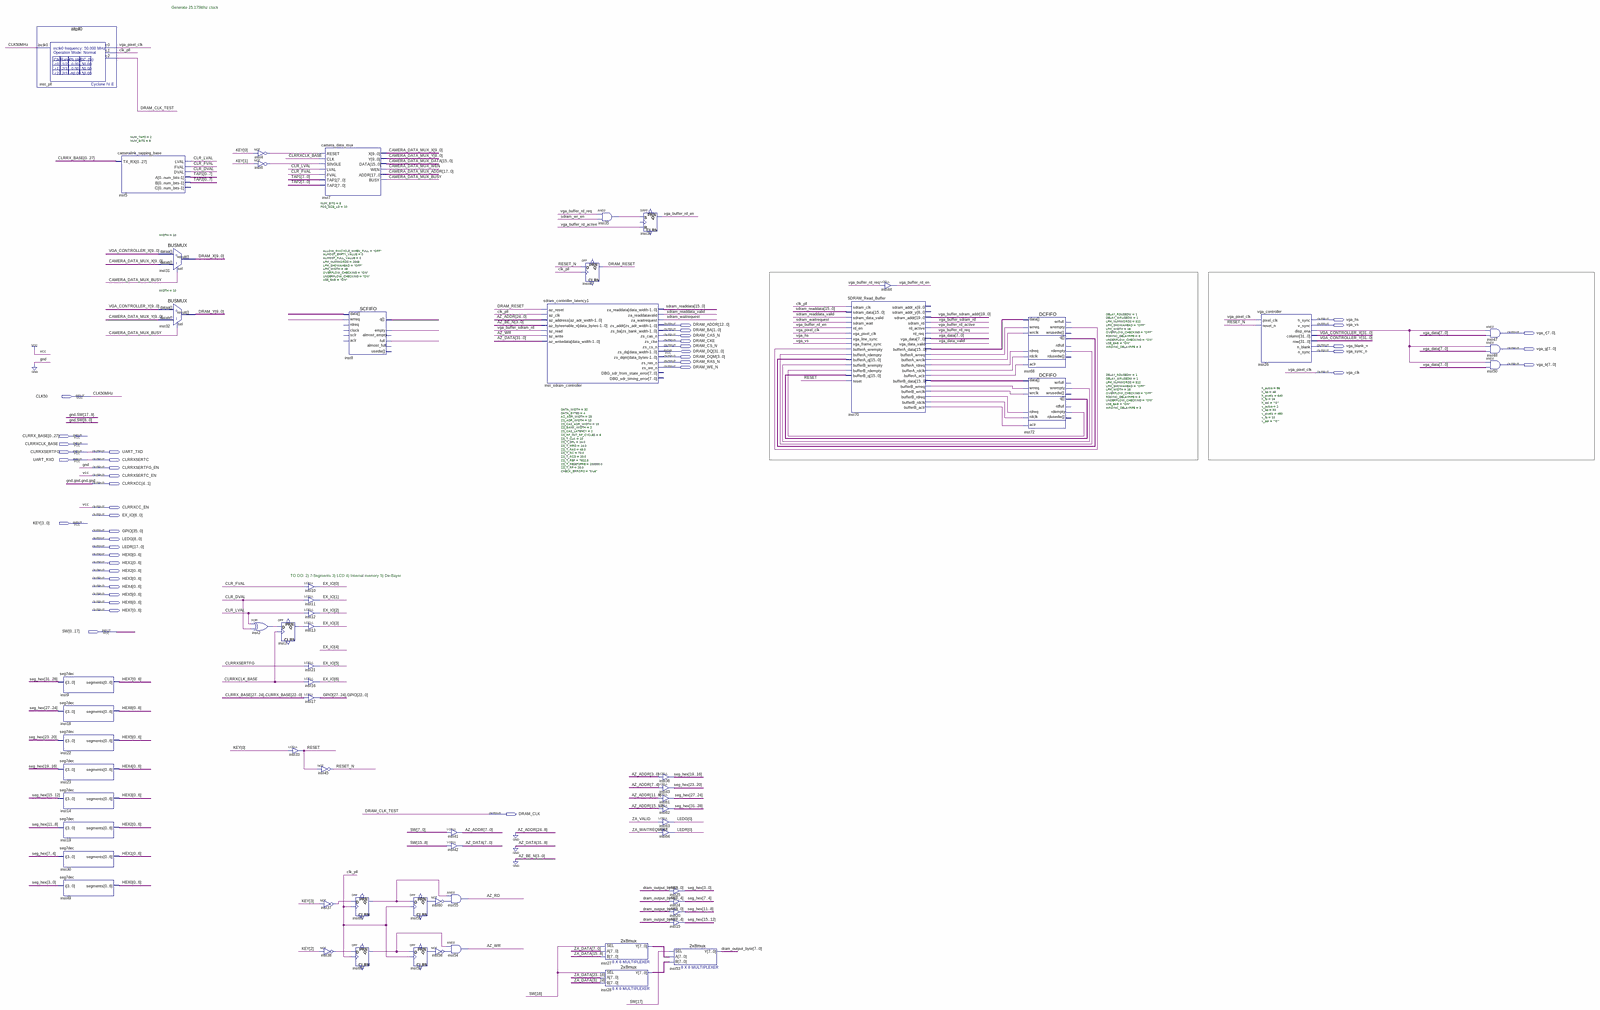
[diagram p0: schematic sheet, whole]
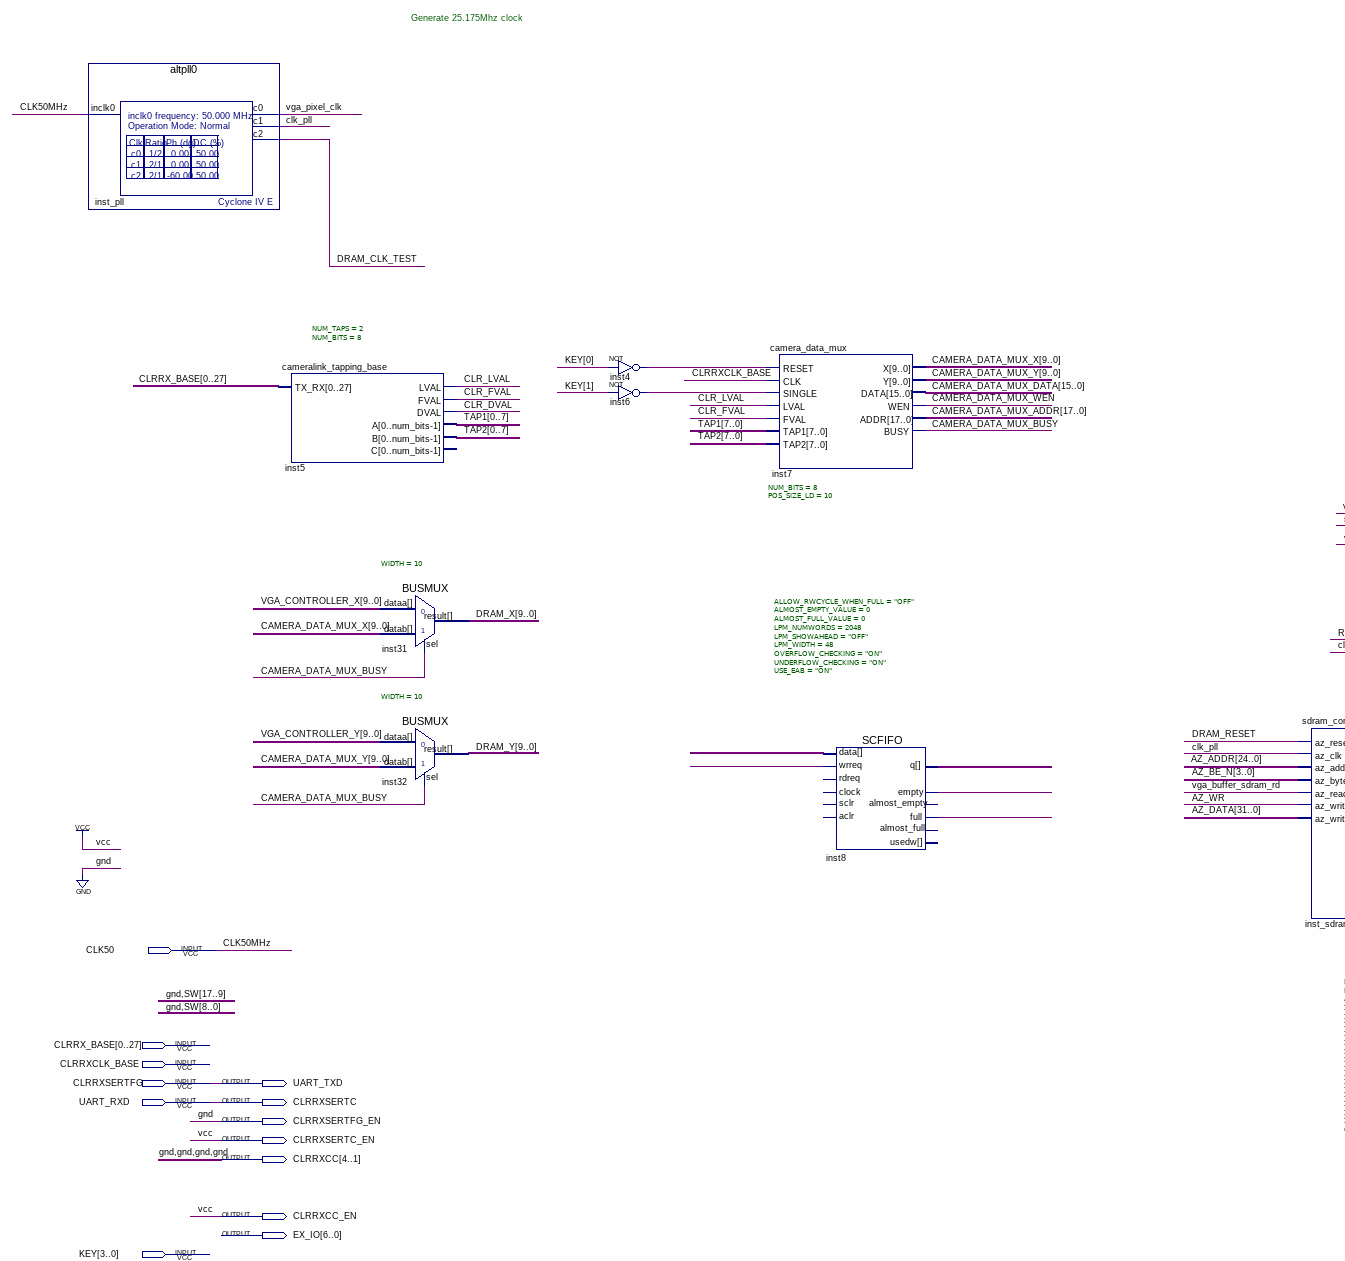
[diagram p1: schematic sheet, upper left part]
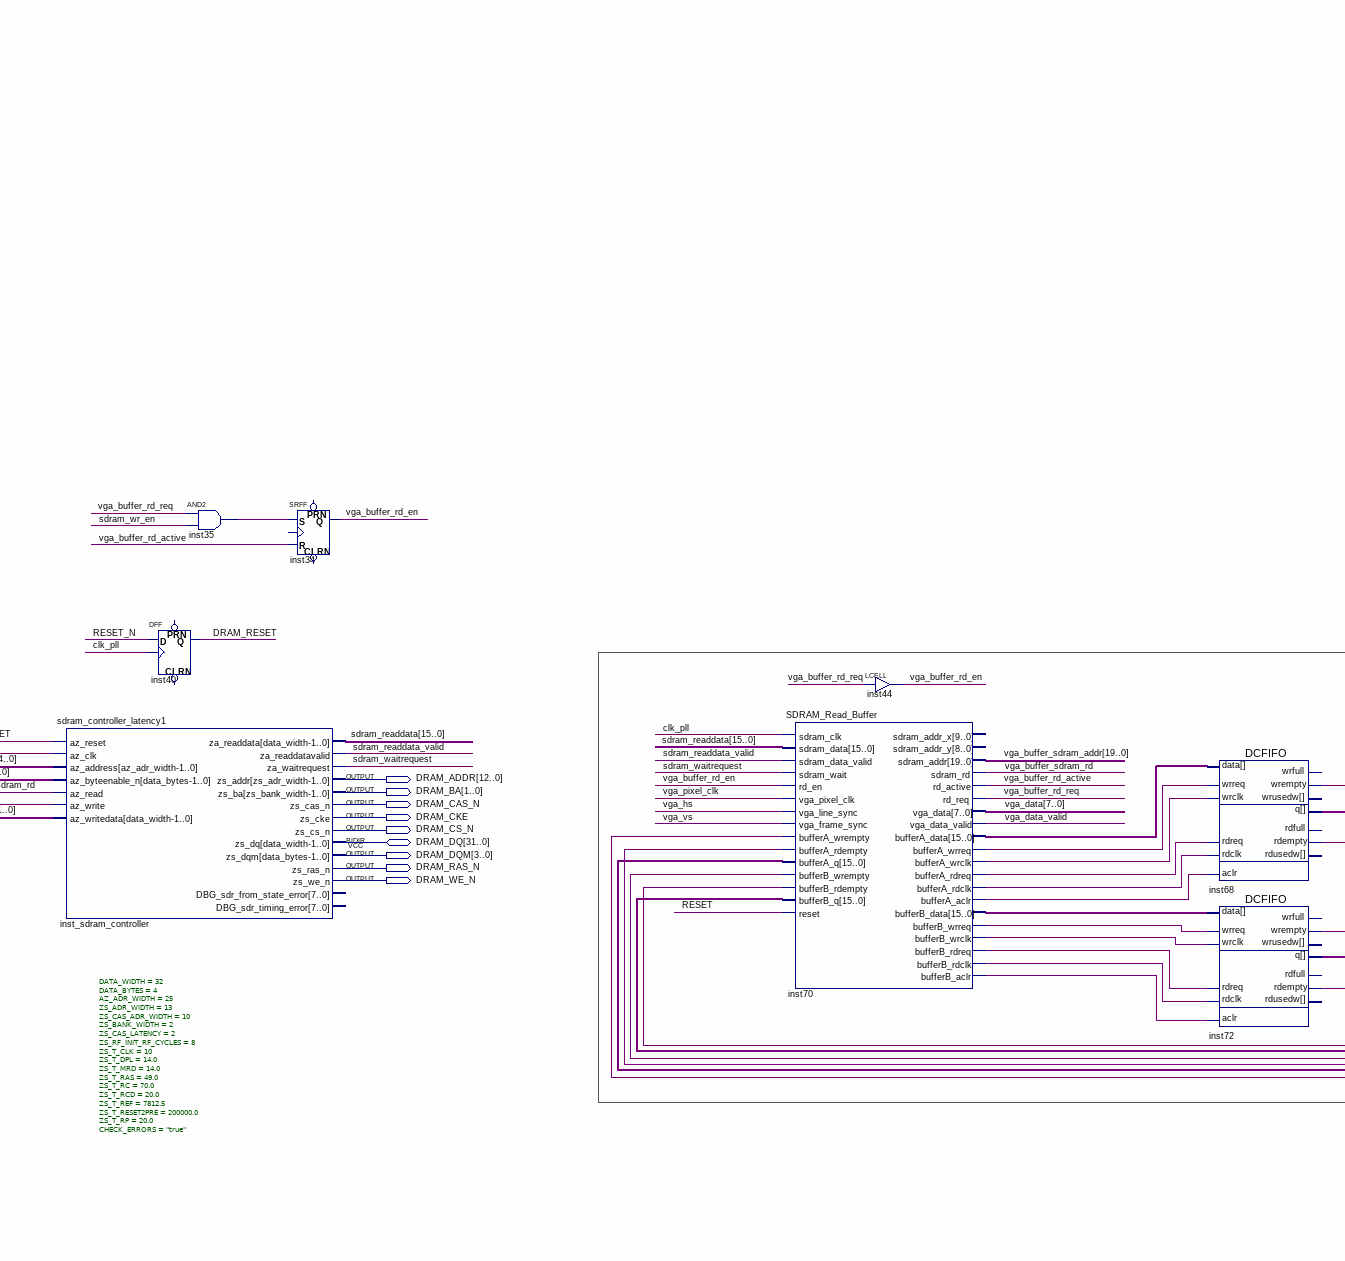
[diagram p2: schematic sheet, upper centre part]
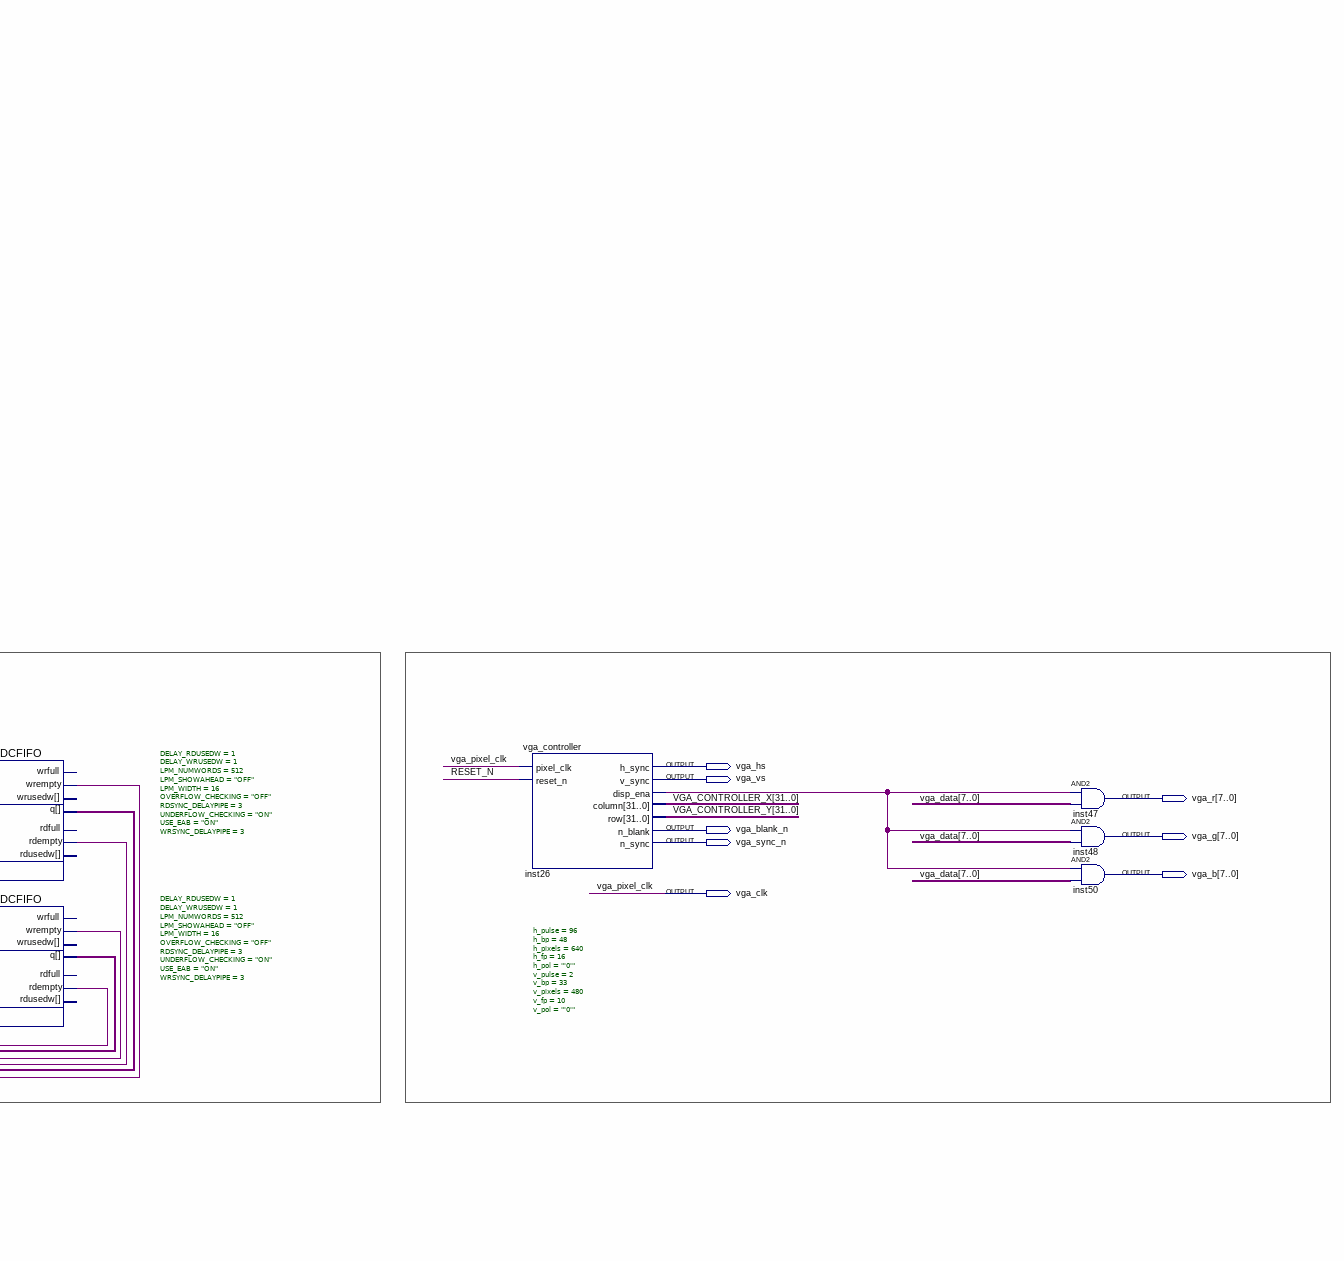
[diagram p3: schematic sheet, upper right part]
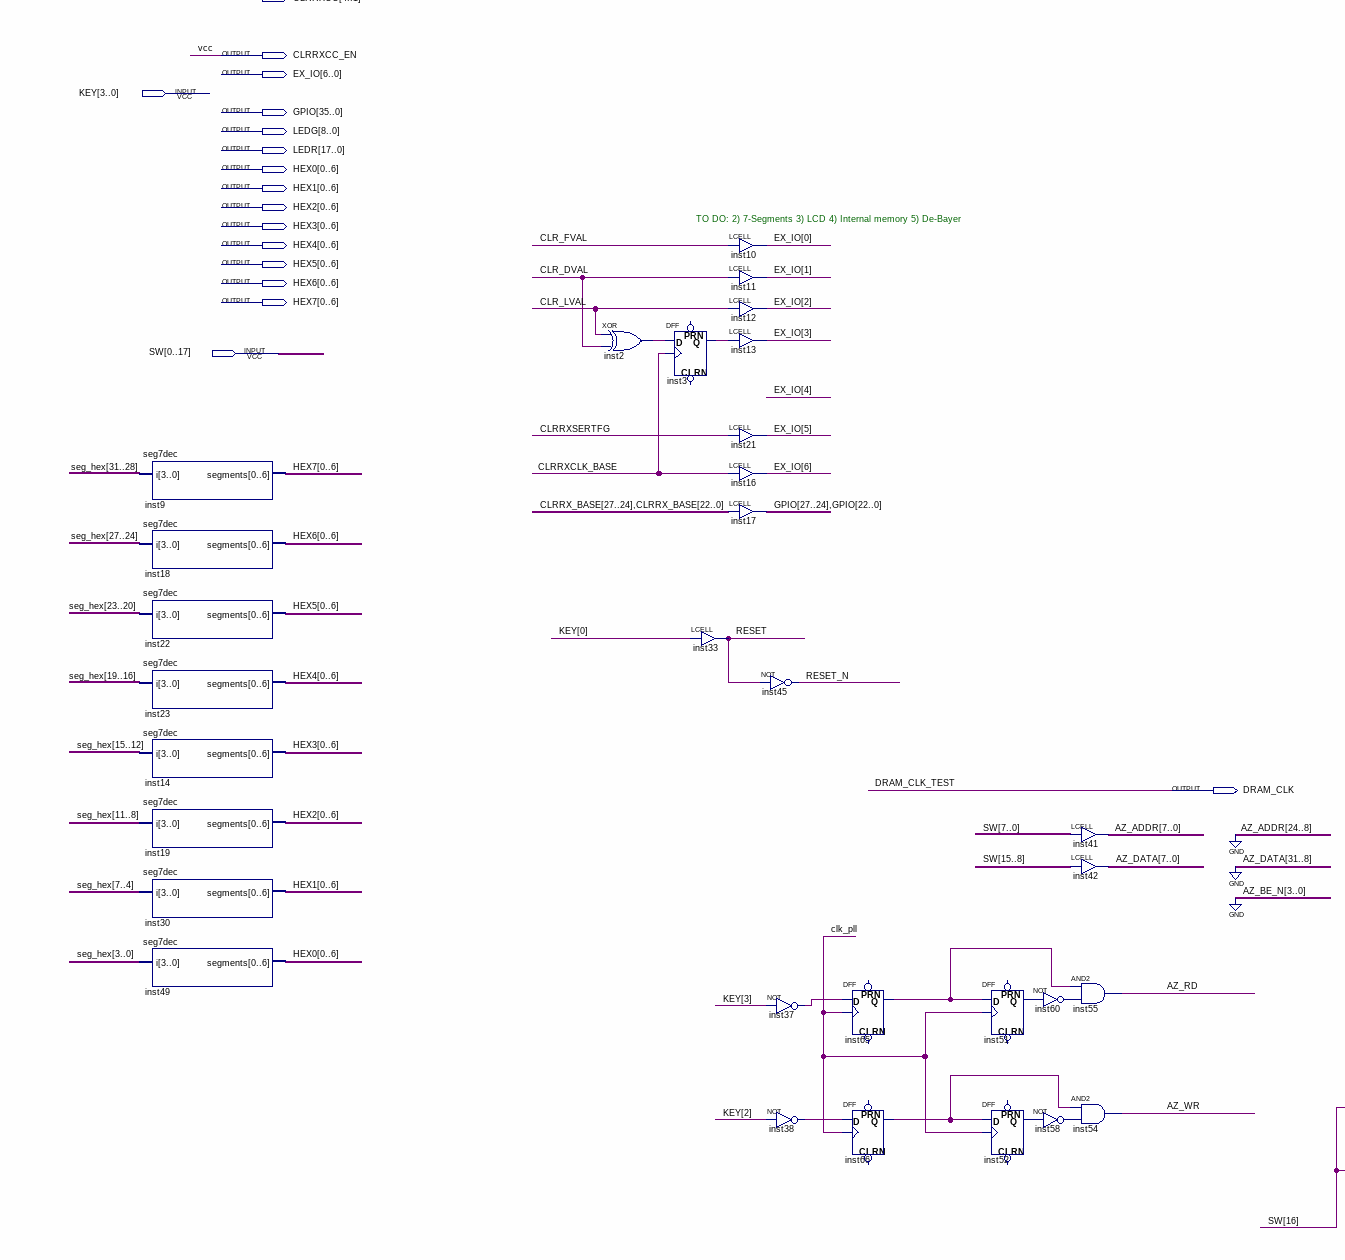
[diagram p4: schematic sheet, lower left part]
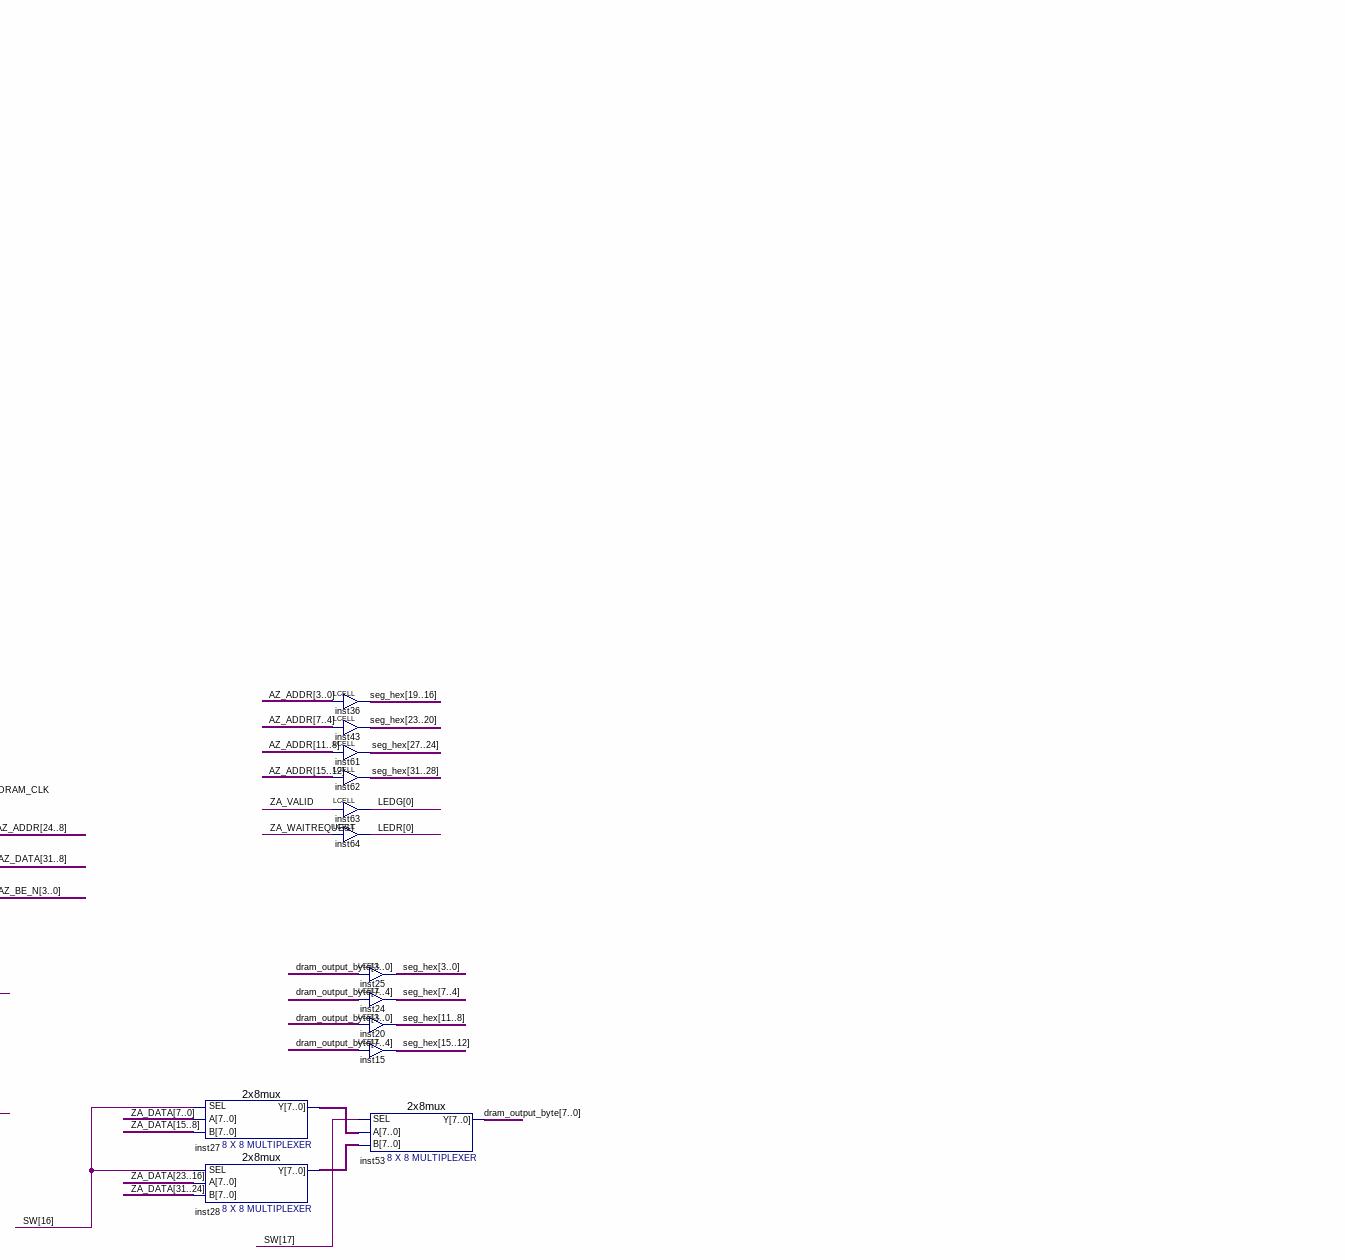
[diagram p5: schematic sheet, lower centre part]
// Quartus schematic sdram-read-buffer-fifo.bdf as structural Verilog: 64 symbols, 43 pins
module \sdram-read-buffer-fifo  (
  input  CLK50,
  input  [0:27] CLRRX_BASE,
  input  CLRRXCLK_BASE,
  input  CLRRXSERTFG,
  input  UART_RXD,
  input  [3:0] KEY,
  input  [0:17] SW,
  inout  [31:0] DRAM_DQ,
  output vga_hs,
  output [12:0] DRAM_ADDR,
  output vga_vs,
  output [1:0] DRAM_BA,
  output [7:0] vga_r,
  output DRAM_CAS_N,
  output DRAM_CKE,
  output DRAM_CS_N,
  output vga_blank_n,
  output [7:0] vga_g,
  output vga_sync_n,
  output [3:0] DRAM_DQM,
  output DRAM_RAS_N,
  output [7:0] vga_b,
  output DRAM_WE_N,
  output vga_clk,
  output UART_TXD,
  output CLRRXSERTC,
  output CLRRXSERTFG_EN,
  output CLRRXSERTC_EN,
  output [4:1] CLRRXCC,
  output CLRRXCC_EN,
  output [6:0] EX_IO,
  output [35:0] GPIO,
  output [8:0] LEDG,
  output [17:0] LEDR,
  output [0:6] HEX0,
  output [0:6] HEX1,
  output [0:6] HEX2,
  output [0:6] HEX3,
  output [0:6] HEX4,
  output [0:6] HEX5,
  output [0:6] HEX6,
  output [0:6] HEX7,
  output DRAM_CLK
);

  wire AZ_RD, AZ_WR, CAMERA_DATA_MUX_BUSY, CAMERA_DATA_MUX_WEN, clk_pll, CLR_DVAL, CLR_FVAL, CLR_LVAL,
       DRAM_RESET, inst2_out, inst3_q, inst4_out, inst6_out, inst8_empty, inst8_full, inst26_disp_ena,
       inst35_out, inst37_out, inst38_out, inst51_q, inst52_q, inst58_out, inst60_out, inst65_q, inst66_q,
       inst68_rdempty, inst68_wrempty, inst70_buffera_aclr, inst70_buffera_rdclk, inst70_buffera_rdreq,
       inst70_buffera_wrclk, inst70_buffera_wrreq, inst70_bufferb_aclr, inst70_bufferb_rdclk,
       inst70_bufferb_rdreq, inst70_bufferb_wrclk, inst70_bufferb_wrreq, inst72_rdempty, inst72_wrempty,
       RESET, RESET_N, sdram_readdata_valid, sdram_waitrequest, sdram_wr_en, undriven_2,
       vga_buffer_rd_active, vga_buffer_rd_en, vga_buffer_rd_req, vga_buffer_sdram_rd, vga_data_valid,
       ZA_VALID, ZA_WAITREQUEST;
  wire [7:0] AZ_ADDR, AZ_DATA, dram_output_byte, inst27_y, inst28_y, TAP1, TAP2, vga_data;
  wire [9:0] CAMERA_DATA_MUX_X, CAMERA_DATA_MUX_Y, DRAM_X, DRAM_Y;
  wire [15:0] CAMERA_DATA_MUX_DATA, inst68_q, inst70_buffera_data, inst70_bufferb_data, inst72_q,
       sdram_readdata;
  wire [17:0] CAMERA_DATA_MUX_ADDR;
  wire [19:0] vga_buffer_sdram_addr;
  wire [31:0] seg_hex, VGA_CONTROLLER_X, VGA_CONTROLLER_Y, ZA_DATA;
  wire [47:0] inst8_q, undriven;

  altpll0 inst_pll (.inclk0(CLK50), .c0(vga_clk), .c1(clk_pll), .c2(DRAM_CLK));
  seg7dec inst9 (.i(seg_hex[31:28]), .segments(HEX7));
  seg7dec inst18 (.i(seg_hex[27:24]), .segments(HEX6));
  seg7dec inst22 (.i(seg_hex[23:20]), .segments(HEX5));
  seg7dec inst23 (.i(seg_hex[19:16]), .segments(HEX4));
  seg7dec inst14 (.i(seg_hex[15:12]), .segments(HEX3));
  seg7dec inst19 (.i(seg_hex[11:8]), .segments(HEX2));
  seg7dec inst30 (.i(seg_hex[7:4]), .segments(HEX1));
  seg7dec inst49 (.i(seg_hex[3:0]), .segments(HEX0));
  cameralink_tapping_base #(.NUM_TAPS(2), .NUM_BITS(8)) inst5 (
    .TX_RX(CLRRX_BASE), .LVAL(CLR_LVAL), .FVAL(CLR_FVAL), .DVAL(CLR_DVAL),
    .A({TAP1[0], TAP1[1], TAP1[2], TAP1[3], TAP1[4], TAP1[5], TAP1[6], TAP1[7]}),
    .B({TAP2[0], TAP2[1], TAP2[2], TAP2[3], TAP2[4], TAP2[5], TAP2[6], TAP2[7]}));  // open: C
  BUSMUX #(.WIDTH(10)) inst31 (
    .datab(CAMERA_DATA_MUX_X), .sel(CAMERA_DATA_MUX_BUSY), .dataa(VGA_CONTROLLER_X[9:0]), .result(DRAM_X));
  BUSMUX #(.WIDTH(10)) inst32 (
    .datab(CAMERA_DATA_MUX_Y), .sel(CAMERA_DATA_MUX_BUSY), .dataa(VGA_CONTROLLER_Y[9:0]), .result(DRAM_Y));
  not inst4 (inst4_out, KEY[0]);
  not inst6 (inst6_out, KEY[1]);
  xor inst2 (inst2_out, CLR_LVAL, CLR_DVAL);
  DFF inst3 (.CLK(CLRRXCLK_BASE), .D(inst2_out), .Q(inst3_q));  // open: CLRN, PRN
  LCELL inst33 (.IN(KEY[0]), .OUT(RESET));
  camera_data_mux #(.NUM_BITS(8), .POS_SIZE_LD(10)) inst7 (
    .RESET(inst4_out), .CLK(CLRRXCLK_BASE), .SINGLE(inst6_out), .LVAL(CLR_LVAL), .FVAL(CLR_FVAL),
    .TAP1(TAP1), .TAP2(TAP2), .X(CAMERA_DATA_MUX_X), .Y(CAMERA_DATA_MUX_Y), .DATA(CAMERA_DATA_MUX_DATA),
    .WEN(CAMERA_DATA_MUX_WEN), .ADDR(CAMERA_DATA_MUX_ADDR), .BUSY(CAMERA_DATA_MUX_BUSY));
  LCELL inst10 (.IN(CLR_FVAL), .OUT(EX_IO[0]));
  LCELL inst11 (.IN(CLR_DVAL), .OUT(EX_IO[1]));
  LCELL inst12 (.IN(CLR_LVAL), .OUT(EX_IO[2]));
  LCELL inst13 (.IN(inst3_q), .OUT(EX_IO[3]));
  LCELL inst21 (.IN(CLRRXSERTFG), .OUT(EX_IO[5]));
  LCELL inst16 (.IN(CLRRXCLK_BASE), .OUT(EX_IO[6]));
  LCELL inst17[26:0] (
    .IN({CLRRX_BASE[27], CLRRX_BASE[26], CLRRX_BASE[25], CLRRX_BASE[24], CLRRX_BASE[22], CLRRX_BASE[21], CLRRX_BASE[20], CLRRX_BASE[19], CLRRX_BASE[18], CLRRX_BASE[17], CLRRX_BASE[16], CLRRX_BASE[15], CLRRX_BASE[14], CLRRX_BASE[13], CLRRX_BASE[12], CLRRX_BASE[11], CLRRX_BASE[10], CLRRX_BASE[9], CLRRX_BASE[8], CLRRX_BASE[7], CLRRX_BASE[6], CLRRX_BASE[5], CLRRX_BASE[4], CLRRX_BASE[3], CLRRX_BASE[2], CLRRX_BASE[1], CLRRX_BASE[0]}),
    .OUT({GPIO[27:24], GPIO[22:0]}));
  not inst45 (RESET_N, RESET);
  not inst37 (inst37_out, KEY[3]);
  not inst38 (inst38_out, KEY[2]);
  SCFIFO #(.ALLOW_RWCYCLE_WHEN_FULL("OFF"), .ALMOST_EMPTY_VALUE(0), .ALMOST_FULL_VALUE(0), .LPM_NUMWORDS(2048), .LPM_SHOWAHEAD("OFF"), .LPM_WIDTH(48), .OVERFLOW_CHECKING("ON"), .UNDERFLOW_CHECKING("ON"), .USE_EAB("ON")) inst8 (
    .data(undriven), .wrreq(undriven_2), .q(inst8_q), .empty(inst8_empty), .full(inst8_full));  // open: clock, rdreq, aclr, sclr, almost_empty, usedw, almost_full
  DFF inst65 (.CLK(clk_pll), .D(inst37_out), .Q(inst65_q));  // open: CLRN, PRN
  DFF inst66 (.CLK(clk_pll), .D(inst38_out), .Q(inst66_q));  // open: CLRN, PRN
  DFF inst51 (.CLK(clk_pll), .D(inst65_q), .Q(inst51_q));  // open: CLRN, PRN
  DFF inst52 (.CLK(clk_pll), .D(inst66_q), .Q(inst52_q));  // open: CLRN, PRN
  LCELL inst41[7:0] (.IN({SW[7], SW[6], SW[5], SW[4], SW[3], SW[2], SW[1], SW[0]}), .OUT(AZ_ADDR));
  LCELL inst42[7:0] (.IN({SW[15], SW[14], SW[13], SW[12], SW[11], SW[10], SW[9], SW[8]}), .OUT(AZ_DATA));
  and inst55 (AZ_RD, inst65_q, inst60_out);
  not inst60 (inst60_out, inst51_q);
  and inst54 (AZ_WR, inst66_q, inst58_out);
  not inst58 (inst58_out, inst52_q);
  sdram_controller_latency1 #(.DATA_WIDTH(32), .DATA_BYTES(4), .AZ_ADR_WIDTH(25), .ZS_ADR_WIDTH(13), .ZS_CAS_ADR_WIDTH(10), .ZS_BANK_WIDTH(2), .ZS_CAS_LATENCY(2), .ZS_RF_INIT_RF_CYCLES(8), .ZS_T_CLK(10), .ZS_T_DPL(14.0), .ZS_T_MRD(14.0), .ZS_T_RAS(49.0), .ZS_T_RC(70.0), .ZS_T_RCD(20.0), .ZS_T_REF(7812.5), .ZS_T_RESET2PRE(200000.0), .ZS_T_RP(20.0), .CHECK_ERRORS("true")) inst_sdram_controller (
    .az_reset(DRAM_RESET), .az_clk(clk_pll), .az_address({{17{1'b0}}, AZ_ADDR}), .az_byteenable_n(4'b0000),
    .az_read(vga_buffer_sdram_rd), .az_write(AZ_WR), .az_writedata({{24{1'b0}}, AZ_DATA}),
    .za_readdata(sdram_readdata), .za_readdatavalid(sdram_readdata_valid),
    .za_waitrequest(sdram_waitrequest), .zs_addr(DRAM_ADDR), .zs_ba(DRAM_BA), .zs_cas_n(DRAM_CAS_N),
    .zs_cke(DRAM_CKE), .zs_cs_n(DRAM_CS_N), .zs_dqm(DRAM_DQM), .zs_ras_n(DRAM_RAS_N), .zs_we_n(DRAM_WE_N),
    .zs_dq(DRAM_DQ));  // open: DBG_sdr_from_state_error, DBG_sdr_timing_error
  and inst35 (inst35_out, vga_buffer_rd_req, sdram_wr_en);
  DFF inst40 (.CLK(clk_pll), .D(RESET_N), .Q(DRAM_RESET));  // open: CLRN, PRN
  \2x8mux  inst27 (.SEL(SW[16]), .A(ZA_DATA[7:0]), .B(ZA_DATA[15:8]), .Y(inst27_y));
  \2x8mux  inst28 (.SEL(SW[16]), .A(ZA_DATA[23:16]), .B(ZA_DATA[31:24]), .Y(inst28_y));
  SRFF inst34 (.S(inst35_out), .R(vga_buffer_rd_active), .Q(vga_buffer_rd_en));  // open: PRN, CLRN, CLK
  LCELL inst36[3:0] (.IN(AZ_ADDR[3:0]), .OUT(seg_hex[19:16]));
  LCELL inst43[3:0] (.IN(AZ_ADDR[7:4]), .OUT(seg_hex[23:20]));
  LCELL inst61[3:0] (.IN(4'b0000), .OUT(seg_hex[27:24]));
  LCELL inst62[3:0] (.IN(4'b0000), .OUT(seg_hex[31:28]));
  LCELL inst63 (.IN(ZA_VALID), .OUT(LEDG[0]));
  LCELL inst64 (.IN(ZA_WAITREQUEST), .OUT(LEDR[0]));
  LCELL inst25[3:0] (.IN(dram_output_byte[3:0]), .OUT(seg_hex[3:0]));
  LCELL inst24[3:0] (.IN(dram_output_byte[7:4]), .OUT(seg_hex[7:4]));
  LCELL inst20[3:0] (.IN(dram_output_byte[3:0]), .OUT(seg_hex[11:8]));
  LCELL inst15[3:0] (.IN(dram_output_byte[7:4]), .OUT(seg_hex[15:12]));
  \2x8mux  inst53 (.SEL(SW[17]), .A(inst27_y), .B(inst28_y), .Y(dram_output_byte));
  SDRAM_Read_Buffer inst70 (
    .sdram_clk(clk_pll), .sdram_data(sdram_readdata), .sdram_data_valid(sdram_readdata_valid),
    .sdram_wait(sdram_waitrequest), .rd_en(vga_buffer_rd_en), .vga_pixel_clk(vga_clk),
    .vga_line_sync(vga_hs), .vga_frame_sync(vga_vs), .bufferA_wrempty(inst68_wrempty),
    .bufferA_rdempty(inst68_rdempty), .bufferA_q(inst68_q), .bufferB_wrempty(inst72_wrempty),
    .bufferB_rdempty(inst72_rdempty), .bufferB_q(inst72_q), .reset(RESET),
    .sdram_addr(vga_buffer_sdram_addr), .sdram_rd(vga_buffer_sdram_rd), .rd_active(vga_buffer_rd_active),
    .rd_req(vga_buffer_rd_req), .vga_data(vga_data), .vga_data_valid(vga_data_valid),
    .bufferA_data(inst70_buffera_data), .bufferA_wrreq(inst70_buffera_wrreq),
    .bufferA_wrclk(inst70_buffera_wrclk), .bufferA_rdreq(inst70_buffera_rdreq),
    .bufferA_rdclk(inst70_buffera_rdclk), .bufferA_aclr(inst70_buffera_aclr),
    .bufferB_data(inst70_bufferb_data), .bufferB_wrreq(inst70_bufferb_wrreq),
    .bufferB_wrclk(inst70_bufferb_wrclk), .bufferB_rdreq(inst70_bufferb_rdreq),
    .bufferB_rdclk(inst70_bufferb_rdclk), .bufferB_aclr(inst70_bufferb_aclr));  // open: sdram_addr_x, sdram_addr_y
  LCELL inst44 (.IN(vga_buffer_rd_req), .OUT(vga_buffer_rd_en));
  DCFIFO #(.DELAY_RDUSEDW(1), .DELAY_WRUSEDW(1), .LPM_NUMWORDS(512), .LPM_SHOWAHEAD("OFF"), .LPM_WIDTH(16), .OVERFLOW_CHECKING("OFF"), .RDSYNC_DELAYPIPE(3), .UNDERFLOW_CHECKING("ON"), .USE_EAB("ON"), .WRSYNC_DELAYPIPE(3)) inst68 (
    .data(inst70_buffera_data), .wrclk(inst70_buffera_wrclk), .wrreq(inst70_buffera_wrreq),
    .aclr(inst70_buffera_aclr), .rdclk(inst70_buffera_rdclk), .rdreq(inst70_buffera_rdreq),
    .rdempty(inst68_rdempty), .wrempty(inst68_wrempty), .q(inst68_q));  // open: rdusedw, rdfull, wrfull, wrusedw
  DCFIFO #(.DELAY_RDUSEDW(1), .DELAY_WRUSEDW(1), .LPM_NUMWORDS(512), .LPM_SHOWAHEAD("OFF"), .LPM_WIDTH(16), .OVERFLOW_CHECKING("OFF"), .RDSYNC_DELAYPIPE(3), .UNDERFLOW_CHECKING("ON"), .USE_EAB("ON"), .WRSYNC_DELAYPIPE(3)) inst72 (
    .data(inst70_bufferb_data), .wrclk(inst70_bufferb_wrclk), .wrreq(inst70_bufferb_wrreq),
    .aclr(inst70_bufferb_aclr), .rdclk(inst70_bufferb_rdclk), .rdreq(inst70_bufferb_rdreq),
    .rdempty(inst72_rdempty), .wrempty(inst72_wrempty), .q(inst72_q));  // open: rdusedw, rdfull, wrfull, wrusedw
  vga_controller #(.h_pulse(96), .h_bp(48), .h_pixels(640), .h_fp(16), .h_pol("'0'"), .v_pulse(2), .v_bp(33), .v_pixels(480), .v_fp(10), .v_pol("'0'")) inst26 (
    .pixel_clk(vga_clk), .reset_n(RESET_N), .h_sync(vga_hs), .v_sync(vga_vs), .disp_ena(inst26_disp_ena),
    .column(VGA_CONTROLLER_X), .row(VGA_CONTROLLER_Y), .n_blank(vga_blank_n), .n_sync(vga_sync_n));
  assign vga_r = {8{inst26_disp_ena}} & vga_data;  // AND2 inst47, 8 bits wide
  assign vga_g = {8{inst26_disp_ena}} & vga_data;  // AND2 inst48, 8 bits wide
  assign vga_b = {8{inst26_disp_ena}} & vga_data;  // AND2 inst50, 8 bits wide

  assign CLRRXCC = 4'b0000;
  assign CLRRXCC_EN = 1'b1;
  assign CLRRXSERTC = UART_RXD;
  assign CLRRXSERTC_EN = 1'b1;
  assign CLRRXSERTFG_EN = 1'b0;
  assign UART_TXD = CLRRXSERTFG;

  // Other names for the same wires on the sheet: CLK50MHz = CLK50; DRAM_CLK_TEST = DRAM_CLK; vga_pixel_clk = vga_clk

  // Notes on the sheet:
  //   Generate 25.175Mhz clock
  //   TO DO: 2) 7-Segments 3) LCD 4) Internal memory 5) De-Bayer 
endmodule
